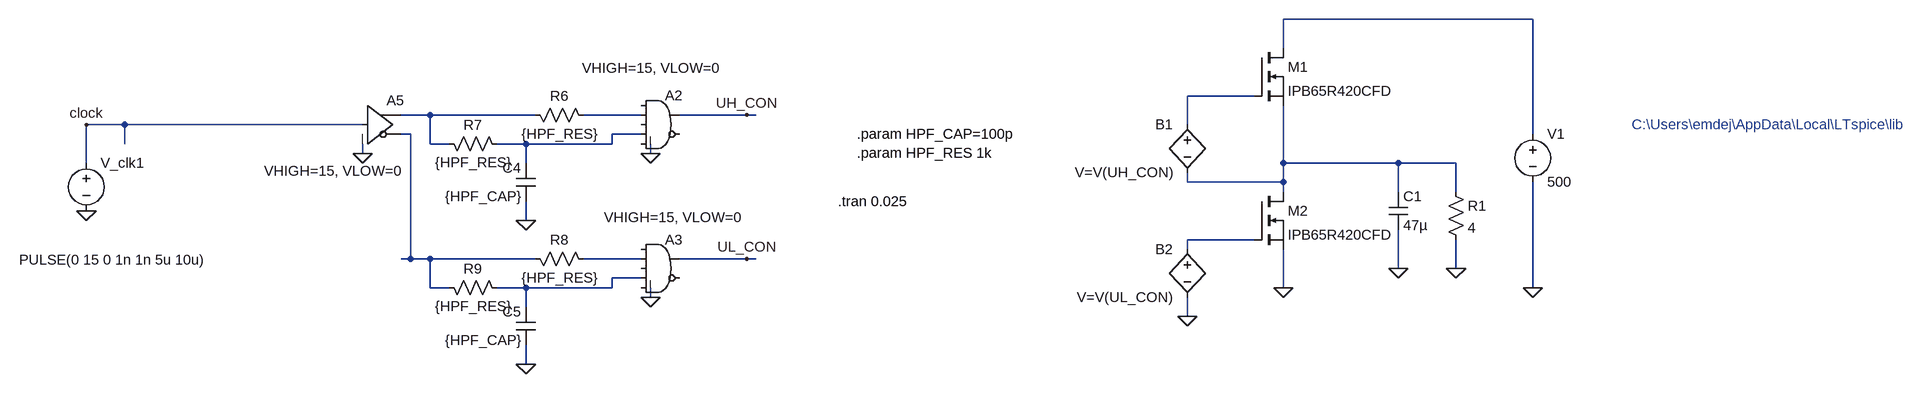
[diagram p0: schematic deadtime.asc]
deadtime.asc, the LTspice schematic file:
Version 4
SHEET 1 3200 1412
WIRE 2480 816 2064 816
WIRE 2064 864 2064 816
WIRE 2016 944 1904 944
WIRE 368 976 320 976
WIRE 544 976 368 976
WIRE 720 976 624 976
WIRE 896 976 784 976
WIRE 912 976 896 976
WIRE -144 992 -208 992
WIRE 256 992 -144 992
WIRE 1904 992 1904 944
WIRE 336 1008 320 1008
WIRE 720 1008 672 1008
WIRE 2480 1008 2480 816
WIRE -144 1024 -144 992
WIRE 368 1024 368 976
WIRE 400 1024 368 1024
WIRE 528 1024 480 1024
WIRE 672 1024 672 1008
WIRE 672 1024 528 1024
WIRE 256 1040 256 1024
WIRE 736 1040 736 1024
WIRE -208 1056 -208 992
WIRE 528 1056 528 1024
WIRE 2064 1056 2064 960
WIRE 2256 1056 2064 1056
WIRE 2352 1056 2256 1056
WIRE 1904 1088 1904 1072
WIRE 2064 1088 2064 1056
WIRE 2064 1088 1904 1088
WIRE 2064 1104 2064 1088
WIRE 2256 1104 2256 1056
WIRE 2352 1104 2352 1056
WIRE 528 1152 528 1120
WIRE 2016 1184 1904 1184
WIRE 1904 1200 1904 1184
WIRE 336 1216 336 1008
WIRE 336 1216 320 1216
WIRE 368 1216 336 1216
WIRE 544 1216 368 1216
WIRE 720 1216 624 1216
WIRE 896 1216 784 1216
WIRE 912 1216 896 1216
WIRE 2256 1232 2256 1168
WIRE 2352 1232 2352 1184
WIRE 720 1248 672 1248
WIRE 368 1264 368 1216
WIRE 400 1264 368 1264
WIRE 528 1264 480 1264
WIRE 672 1264 672 1248
WIRE 672 1264 528 1264
WIRE 2064 1264 2064 1200
WIRE 2480 1264 2480 1088
WIRE 736 1280 736 1264
WIRE 528 1296 528 1264
WIRE 1904 1312 1904 1280
WIRE 528 1392 528 1360
FLAG -208 992 clock
FLAG -208 1136 0
FLAG 896 976 UH_CON
FLAG 896 1216 UL_CON
FLAG 528 1152 0
FLAG 528 1392 0
FLAG 736 1040 0
FLAG 736 1280 0
FLAG 256 1040 0
FLAG 2480 1264 0
FLAG 2064 1264 0
FLAG 1904 1312 0
FLAG 2352 1232 0
FLAG 2256 1232 0
SYMBOL voltage -208 1040 R0
WINDOW 3 -112 178 Left 2
WINDOW 123 0 0 Left 0
WINDOW 39 0 0 Left 0
SYMATTR Value PULSE(0 15 0 1n 1n 5u 10u)
SYMATTR InstName V_clk1
SYMBOL res 640 992 M270
WINDOW 0 32 56 VTop 2
WINDOW 3 0 56 VBottom 2
SYMATTR InstName R6
SYMATTR Value {HPF_RES}
SYMBOL Digital\\and 752 928 R0
WINDOW 3 -130 -30 Left 2
SYMATTR Value VHIGH=15, VLOW=0
SYMATTR InstName A2
SYMBOL Digital\\and 752 1168 R0
WINDOW 3 -94 -21 Left 2
SYMATTR Value VHIGH=15, VLOW=0
SYMATTR InstName A3
SYMBOL Digital\\buf 256 928 R0
WINDOW 3 -164 141 Left 2
SYMATTR Value VHIGH=15, VLOW=0
SYMATTR InstName A5
SYMBOL res 496 1040 M270
WINDOW 0 32 56 VTop 2
WINDOW 3 0 56 VBottom 2
SYMATTR InstName R7
SYMATTR Value {HPF_RES}
SYMBOL res 640 1232 M270
WINDOW 0 32 56 VTop 2
WINDOW 3 0 56 VBottom 2
SYMATTR InstName R8
SYMATTR Value {HPF_RES}
SYMBOL res 496 1280 M270
WINDOW 0 32 56 VTop 2
WINDOW 3 0 56 VBottom 2
SYMATTR InstName R9
SYMATTR Value {HPF_RES}
SYMBOL cap 544 1056 M0
SYMATTR InstName C4
SYMATTR Value {HPF_CAP}
SYMBOL cap 544 1296 M0
SYMATTR InstName C5
SYMATTR Value {HPF_CAP}
SYMBOL nmos 2016 864 R0
SYMATTR InstName M1
SYMATTR Value IPB65R420CFD
SYMBOL nmos 2016 1104 R0
SYMATTR InstName M2
SYMATTR Value IPB65R420CFD
SYMBOL bv 1904 976 M0
SYMATTR InstName B1
SYMATTR Value V=V(UH_CON)
SYMBOL bv 1904 1184 M0
SYMATTR InstName B2
SYMATTR Value V=V(UL_CON)
SYMBOL voltage 2480 992 R0
WINDOW 123 0 0 Left 0
WINDOW 39 0 0 Left 0
SYMATTR InstName V1
SYMATTR Value 500
SYMBOL cap 2240 1104 R0
SYMATTR InstName C1
SYMATTR Value 47µ
SYMBOL res 2336 1088 R0
SYMATTR InstName R1
SYMATTR Value 4
TEXT 1240 1120 Left 2 !.tran 0.025
TEXT 1272 1008 Left 2 !.param HPF_CAP=100p\n.param HPF_RES 1k
TEXT 2680 992 Left 2 ;C:\\Users\\emdej\\AppData\\Local\\LTspice\\lib

The netlist it stands for:
* deadtime.asc
V_clk1 clock 0 PULSE(0 15 0 1n 1n 5u 10u)
R6 N004 N003 {HPF_RES}
A2 0 N004 0 N006 0 0 UH_CON 0 AND VHIGH=15, VLOW=0
A3 0 N009 0 N010 0 0 UL_CON 0 AND VHIGH=15, VLOW=0
A5 clock 0 0 0 0 N005 N003 0 BUF VHIGH=15, VLOW=0
R7 N006 N003 {HPF_RES}
R8 N009 N005 {HPF_RES}
R9 N010 N005 {HPF_RES}
C4 N006 0 {HPF_CAP}
C5 N010 0 {HPF_CAP}
M1 N001 N002 N007 N007 IPB65R420CFD
M2 N007 N008 0 0 IPB65R420CFD
B1 N002 N007 V=V(UH_CON)
B2 N008 0 V=V(UL_CON)
V1 N001 0 500
C1 N007 0 47µ
R1 N007 0 4
.model NMOS NMOS
.model PMOS PMOS
.lib standard.mos
.tran 0.025
.param HPF_CAP=100p
.param HPF_RES 1k
* C:\Users\emdej\AppData\Local\LTspice\lib
.backanno
.end